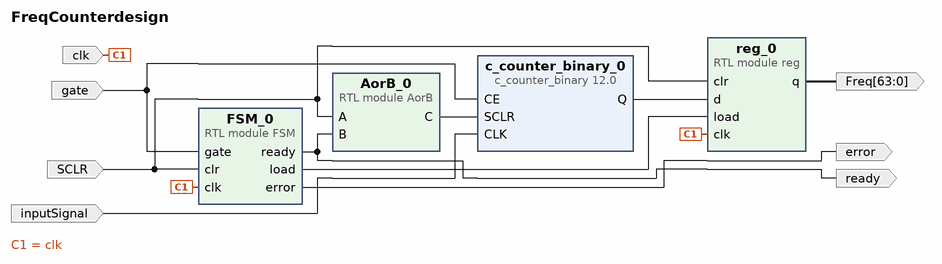
[diagram p0: block diagram of the top level]
# Vivado block design FreqCounterdesign, xc7z020clg400-1, Vivado 2020.1
create_bd_design FreqCounterdesign

create_bd_port -dir I gate
create_bd_port -dir I clk
create_bd_port -dir I inputSignal
create_bd_port -dir O error
create_bd_port -dir O -from 63 -to 0 Freq
create_bd_port -dir O ready
create_bd_port -dir I -type rst SCLR
set_property -dict {CONFIG.POLARITY ACTIVE_HIGH} [get_bd_ports SCLR]

create_bd_cell -type ip -vlnv xilinx.com:ip:c_counter_binary:12.0 c_counter_binary_0
set_property -dict {CONFIG.CE true CONFIG.Output_Width 64 CONFIG.SCLR true CONFIG.SSET false} [get_bd_cells c_counter_binary_0]
create_bd_cell -type module -reference reg reg_0
create_bd_cell -type module -reference AorB AorB_0
create_bd_cell -type module -reference FSM FSM_0

# ---- connections ----

connect_bd_net [get_bd_pins FSM_0/load] [get_bd_pins reg_0/load]
connect_bd_net [get_bd_ports gate] [get_bd_pins c_counter_binary_0/CE] [get_bd_pins FSM_0/gate]
connect_bd_net [get_bd_ports SCLR] [get_bd_pins AorB_0/A] [get_bd_pins reg_0/clr] [get_bd_pins FSM_0/clr]
connect_bd_net [get_bd_ports clk] [get_bd_pins reg_0/clk] [get_bd_pins FSM_0/clk]
connect_bd_net [get_bd_ports inputSignal] [get_bd_pins c_counter_binary_0/CLK]
connect_bd_net [get_bd_pins c_counter_binary_0/Q] [get_bd_pins reg_0/d]
connect_bd_net [get_bd_pins FSM_0/ready] [get_bd_pins AorB_0/B] [get_bd_ports ready]
connect_bd_net [get_bd_pins AorB_0/C] [get_bd_pins c_counter_binary_0/SCLR]
connect_bd_net [get_bd_pins FSM_0/error] [get_bd_ports error]
connect_bd_net [get_bd_pins reg_0/q] [get_bd_ports Freq]

validate_bd_design
save_bd_design
